# EAGLE design IcosaCharlieCylon (EAGLE 7.5.0)
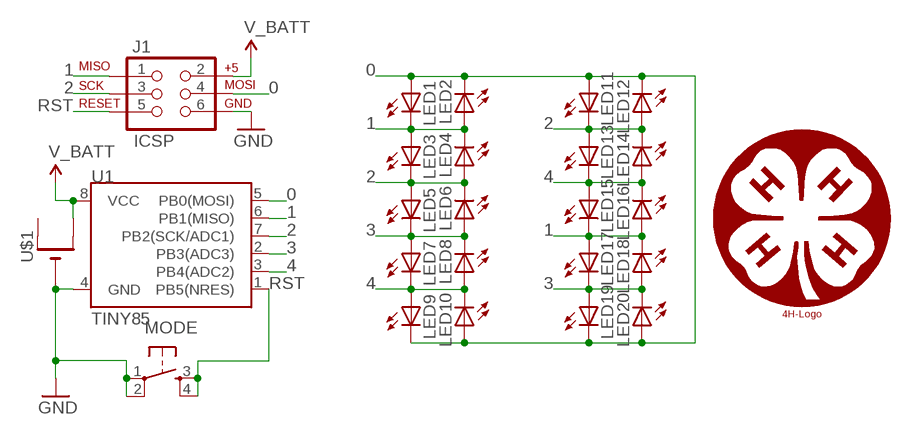
[diagram p0: schematic, sheet 1]

## Parts
J1  ICSP  AVR_SPI_PRG_6LABELED  [2X3-NS]
LED1  LEDOVAL  [LED-OVAL]
LED2  LEDOVAL  [LED-OVAL]
LED3  LEDOVAL  [LED-OVAL]
LED4  LEDOVAL  [LED-OVAL]
LED5  LEDOVAL  [LED-OVAL]
LED6  LEDOVAL  [LED-OVAL]
LED7  LEDOVAL  [LED-OVAL]
LED8  LEDOVAL  [LED-OVAL]
LED9  LEDOVAL  [LED-OVAL]
LED10  LEDOVAL  [LED-OVAL]
LED11  LEDOVAL  [LED-OVAL]
LED12  LEDOVAL  [LED-OVAL]
LED13  LEDOVAL  [LED-OVAL]
LED14  LEDOVAL  [LED-OVAL]
LED15  LEDOVAL  [LED-OVAL]
LED16  LEDOVAL  [LED-OVAL]
LED17  LEDOVAL  [LED-OVAL]
LED18  LEDOVAL  [LED-OVAL]
LED19  LEDOVAL  [LED-OVAL]
LED20  LEDOVAL  [LED-OVAL]
MODE  TAC_SWITCHPTH  [TACTILE-PTH]
U1  TINY85  ATTINY45TINY85-20-DIP  [DIP08]
U$1  CR2032THM  [CR2032-THRU]
U$3  4H-LOGO6  [4H_LOGO_6]

## Nets
0: J1.4(MOSI) LED1.ANODE(A) LED2.CATHODE(C) LED9.CATHODE(C) LED10.ANODE(A) LED11.ANODE(A) LED12.CATHODE(C) LED19.CATHODE(C) LED20.ANODE(A) U1.5(PB0(MOSI))
1: J1.1(MISO) LED1.CATHODE(C) LED2.ANODE(A) LED3.ANODE(A) LED4.CATHODE(C) LED15.CATHODE(C) LED16.ANODE(A) LED17.ANODE(A) LED18.CATHODE(C) U1.6(PB1(MISO))
2: J1.3(SCK) LED3.CATHODE(C) LED4.ANODE(A) LED5.ANODE(A) LED6.CATHODE(C) LED11.CATHODE(C) LED12.ANODE(A) LED13.ANODE(A) LED14.CATHODE(C) U1.7(PB2(SCK/ADC1))
3: LED5.CATHODE(C) LED6.ANODE(A) LED7.ANODE(A) LED8.CATHODE(C) LED17.CATHODE(C) LED18.ANODE(A) LED19.ANODE(A) LED20.CATHODE(C) U1.2(PB3(ADC3))
4: LED7.CATHODE(C) LED8.ANODE(A) LED9.ANODE(A) LED10.CATHODE(C) LED13.CATHODE(C) LED14.ANODE(A) LED15.ANODE(A) LED16.CATHODE(C) U1.3(PB4(ADC2))
GND: J1.6(GND) MODE.1 MODE.2 U1.4(GND) U$1.-
RST: J1.5(RST) MODE.3 MODE.4 U1.1(PB5(NRES))
V_BATT: J1.2(V+) U1.8(VCC) U$1.+2(+1)
Unconnected: U$1.+1(+)

## Library data of the parts
J1 = barbary_enterprises:AVR_SPI_PRG_6: AVR ISP 6 Pin This is the reduced ISP connector for AVR programming. Common on Arduino. This footprint will take up less PCB space and can be used with a 10-pin to 6-pin adapter such as SKU: BOB-08508
LED1-LED20 = barbary_enterprises:LED: LEDs Standard schematic elements and footprints for 5mm, 3mm, 1206, and 0603 sized LEDs. 5mm - Spark Fun Electronics SKU : COM-00529 (and others)
MODE = barbary_enterprises:TAC_SWITCH: Momentary Switch Button commonly used for reset or general input. Spark Fun Electronics SKU : COM-00097 SMT- SWCH-08247
U1 = SparkFun-DigitalIC:ATTINY45: Atmel 8-pin 2/4/8kB flash uC; PROD_ID: IC-09445; VALUE: TINY85-20-DIP
U$1 = battery:CR2032
U$3 = 4h:4H-LOGO: 18 USC 707 R=51, G=153, B=102 #339966

## Board
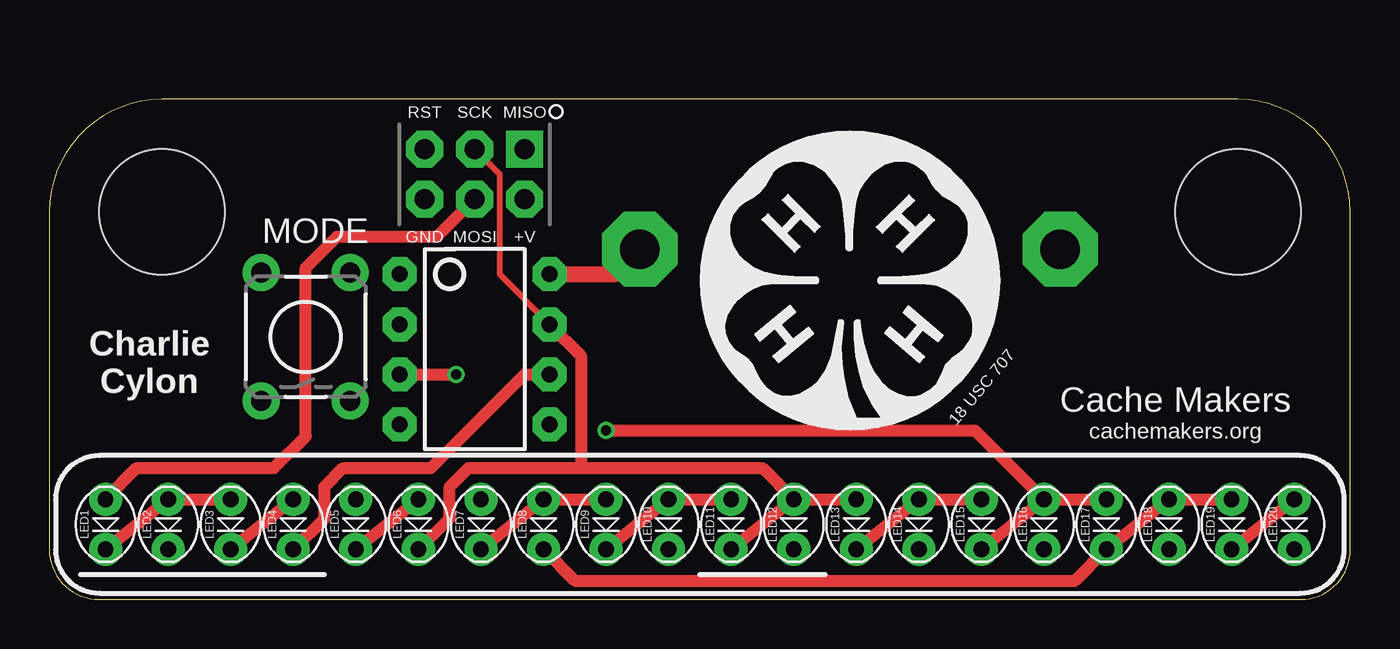
[diagram p1: board, top side]
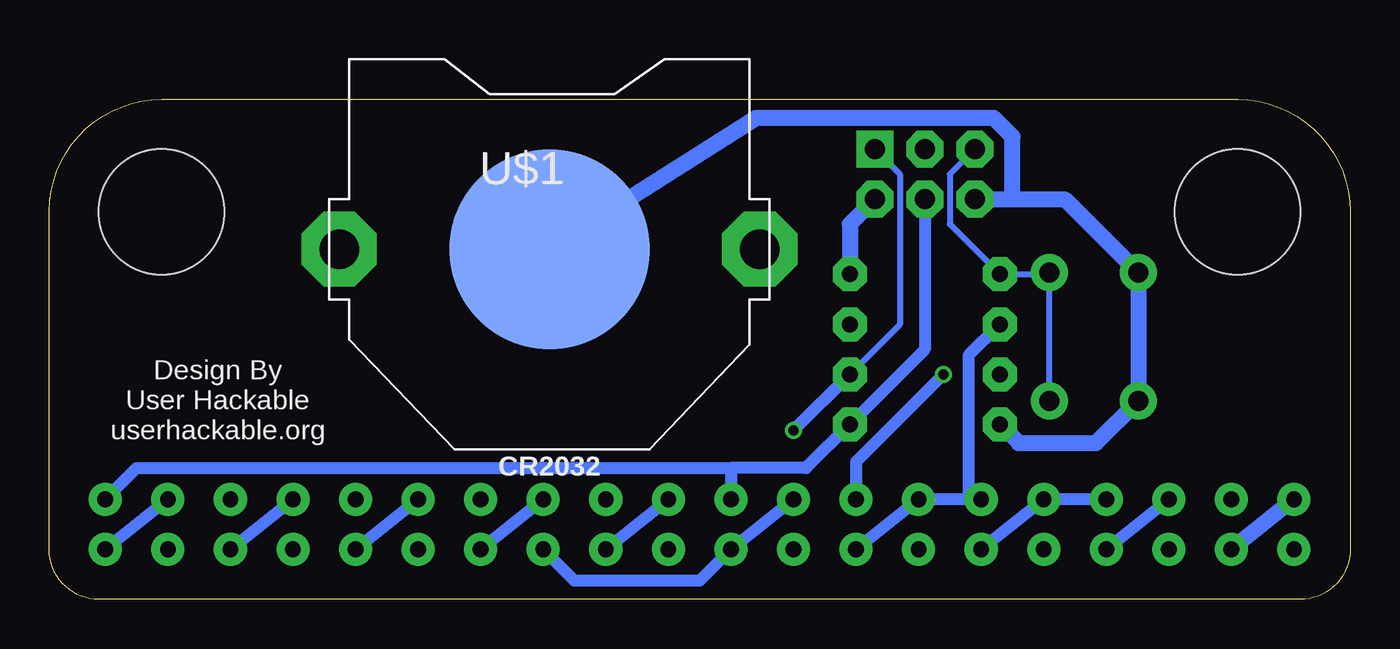
[diagram p2: board, bottom side, seen from below]

Size 66.03 x 25.39 mm. Coordinates in mm from the lower left corner, seen from the top.
Outline: 66.03,2.53 66.03,19.69 arc90 60.33,25.39 5.71,25.39 arc90 0,19.68 0,2.54 arc90 2.54,0 63.5,0 arc90 66.03,2.53
Copper layers (1*16): Top 0.0356mm / dielectric 1.5011mm / Bottom 0.0356mm
Design rules "LaenPCBOrder": minimum track width 6mil, minimum drill 13mil, track to track 6mil, track to pad 6mil, pad to pad 6mil, via to via 6mil, smd to smd 6mil, copper to edge 15mil, drill to drill 6mil, minimum pad ring 7mil, minimum via ring 7mil, stop-mask expansion 3mil, vias tented up to drill 0mil, thermal gap 10mil
Holes 6.38 mm at 5.71,19.68 60.33,19.68

### Footprints (pad centres in the part's own frame; a part is rotated, then mirrored left to right if it is on the bottom)
2X3-NS = drill 1.016 pad 1.88 square: 1 -2.54,-1.27 | drill 1.016 pad 1.88 octagon: 2 -2.54,1.27; 3 0,-1.27; 4 0,1.27; 5 2.54,-1.27; 6 2.54,1.27
LED-OVAL = drill 0.8 pad 1.676: ANODE 1.27,0; CATHODE -1.27,0
TACTILE-PTH = drill 1.016 pad 1.88: 1 -3.251,2.261; 2 3.251,2.261; 3 -3.251,-2.261; 4 3.251,-2.261
DIP08 = drill 0.813 pad 1.727 octagon: 1 -3.81,-3.81; 2 -1.27,-3.81; 3 1.27,-3.81; 4 3.81,-3.81; 5 3.81,3.81; 6 1.27,3.81; 7 -1.27,3.81; 8 -3.81,3.81
CR2032-THRU = drill 2 pad 3.81 octagon: +1 -10.668,0; +2 10.668,0 | smd 10.16 x 10.16: - 0,0

### Placement (x,y rotation side)
J1  21.59,21.59 180 top
LED1  2.86,3.81 90 top
LED2  6.03,3.81 90 top
LED3  9.21,3.81 90 top
LED4  12.38,3.81 90 top
LED5  15.56,3.81 90 top
LED6  18.73,3.81 90 top
LED7  21.91,3.81 90 top
LED8  25.08,3.81 90 top
LED9  28.26,3.81 90 top
LED10  31.43,3.81 90 top
LED11  34.61,3.81 90 top
LED12  37.78,3.81 90 top
LED13  40.96,3.81 90 top
LED14  44.13,3.81 90 top
LED15  47.31,3.81 90 top
LED16  50.48,3.81 90 top
LED17  53.66,3.81 90 top
LED18  56.83,3.81 90 top
LED19  60.01,3.81 90 top
LED20  63.18,3.81 90 top
MODE  13.02,13.34 90 top
U1  21.59,12.7 270 top
U$1  40.64,17.78 0 bottom
U$3  40.64,16.19 0 top

### Tracks (layer width: path | path; a pad name or v marks a point on that pad's centre or on a via)
0
  Top 0.61: LED9.CATHODE LED10.ANODE LED11.ANODE | LED19.CATHODE LED20.ANODE | LED1.ANODE 4.45,6.67 11.4,6.67 13.02,8.29 13.02,16.83 14.61,18.41 19.68,18.41 J1.4
  Bottom 0.61: LED11.ANODE LED12.CATHODE | J1.4 21.59,12.7 U1.5 27.62,6.67 31.43,6.67 | 31.43,6.67 LED10.ANODE | LED20.ANODE 61.59,6.67 31.43,6.67
  Bottom 0.813: LED2.CATHODE LED1.ANODE
1  (via drill 0.51)
  Top 0.61: LED1.CATHODE LED2.ANODE LED3.ANODE | LED15.CATHODE LED16.ANODE | LED16.ANODE LED17.ANODE | v28.26,8.57 46.99,8.57 LED16.ANODE | LED4.CATHODE 13.97,4.13 13.97,5.71 14.92,6.67 19.37,6.67 24.13,11.43 U1.6
  Bottom 0.305: J1.1 22.86,21.59 22.86,13.97 U1.6
  Bottom 0.61: LED3.ANODE LED4.CATHODE | LED17.ANODE LED18.CATHODE | U1.6 v28.26,8.57
2
  Top 0.305: J1.3 22.86,21.59 22.86,16.51 U1.7
  Top 0.61: LED3.CATHODE LED4.ANODE | LED11.CATHODE LED12.ANODE | LED12.ANODE LED13.ANODE | LED12.ANODE 36.2,6.67 26.99,6.67 | LED6.CATHODE 20.32,4.13 20.32,5.71 21.27,6.67 26.99,6.67 | U1.7 26.99,12.38 26.99,6.67
  Bottom 0.61: LED6.CATHODE LED5.ANODE LED4.ANODE | LED13.ANODE LED14.CATHODE | 37.78,5.4 LED12.ANODE
3
  Top 0.61: LED5.CATHODE LED6.ANODE | LED19.ANODE LED18.ANODE LED17.CATHODE 52.07,0.95 26.67,0.95 LED8.CATHODE
  Bottom 0.61: LED8.CATHODE LED7.ANODE 19.37,5.08 | LED19.ANODE LED20.CATHODE | LED6.ANODE 19.37,5.08 | U1.2 19.37,12.38 19.37,5.08
4  (via drill 0.51)
  Top 0.61: LED7.CATHODE LED8.ANODE LED9.ANODE | LED13.CATHODE LED14.ANODE LED15.ANODE | U1.3 v20.64,11.43
  Bottom 0.61: LED9.ANODE LED10.CATHODE 33.02,0.95 39.37,0.95 LED13.CATHODE | LED15.ANODE LED16.CATHODE | v20.64,11.43 25.08,6.99 LED8.ANODE
GND
  Bottom 0.813: 17.14,20.32 17.14,23.5 18.1,24.45 30.16,24.45 U$1.- | J1.6 17.14,20.32 | 17.14,20.32 14.49,20.32 MODE.2 MODE.1 12.9,7.94 16.83,7.94 U1.4
RST
  Bottom 0.305: J1.5 20.32,21.59 20.32,19.05 U1.1 15.28,16.51 MODE.4 MODE.3
V_BATT
  Top 0.813: U1.8 28.7,16.51 U$1.+2
  Bottom 0.813: J1.2 25.4,19.05 U1.8

### Text on the board
tPlace: Charlie / Cylon | 18 USC 707 | Cache Makers | cachemakers.org
bPlace: Design By / User Hackable / userhackable.org | CR2032